# EAGLE design VarmoEmergencyStop - Rev A1 (EAGLE 7.6.0)
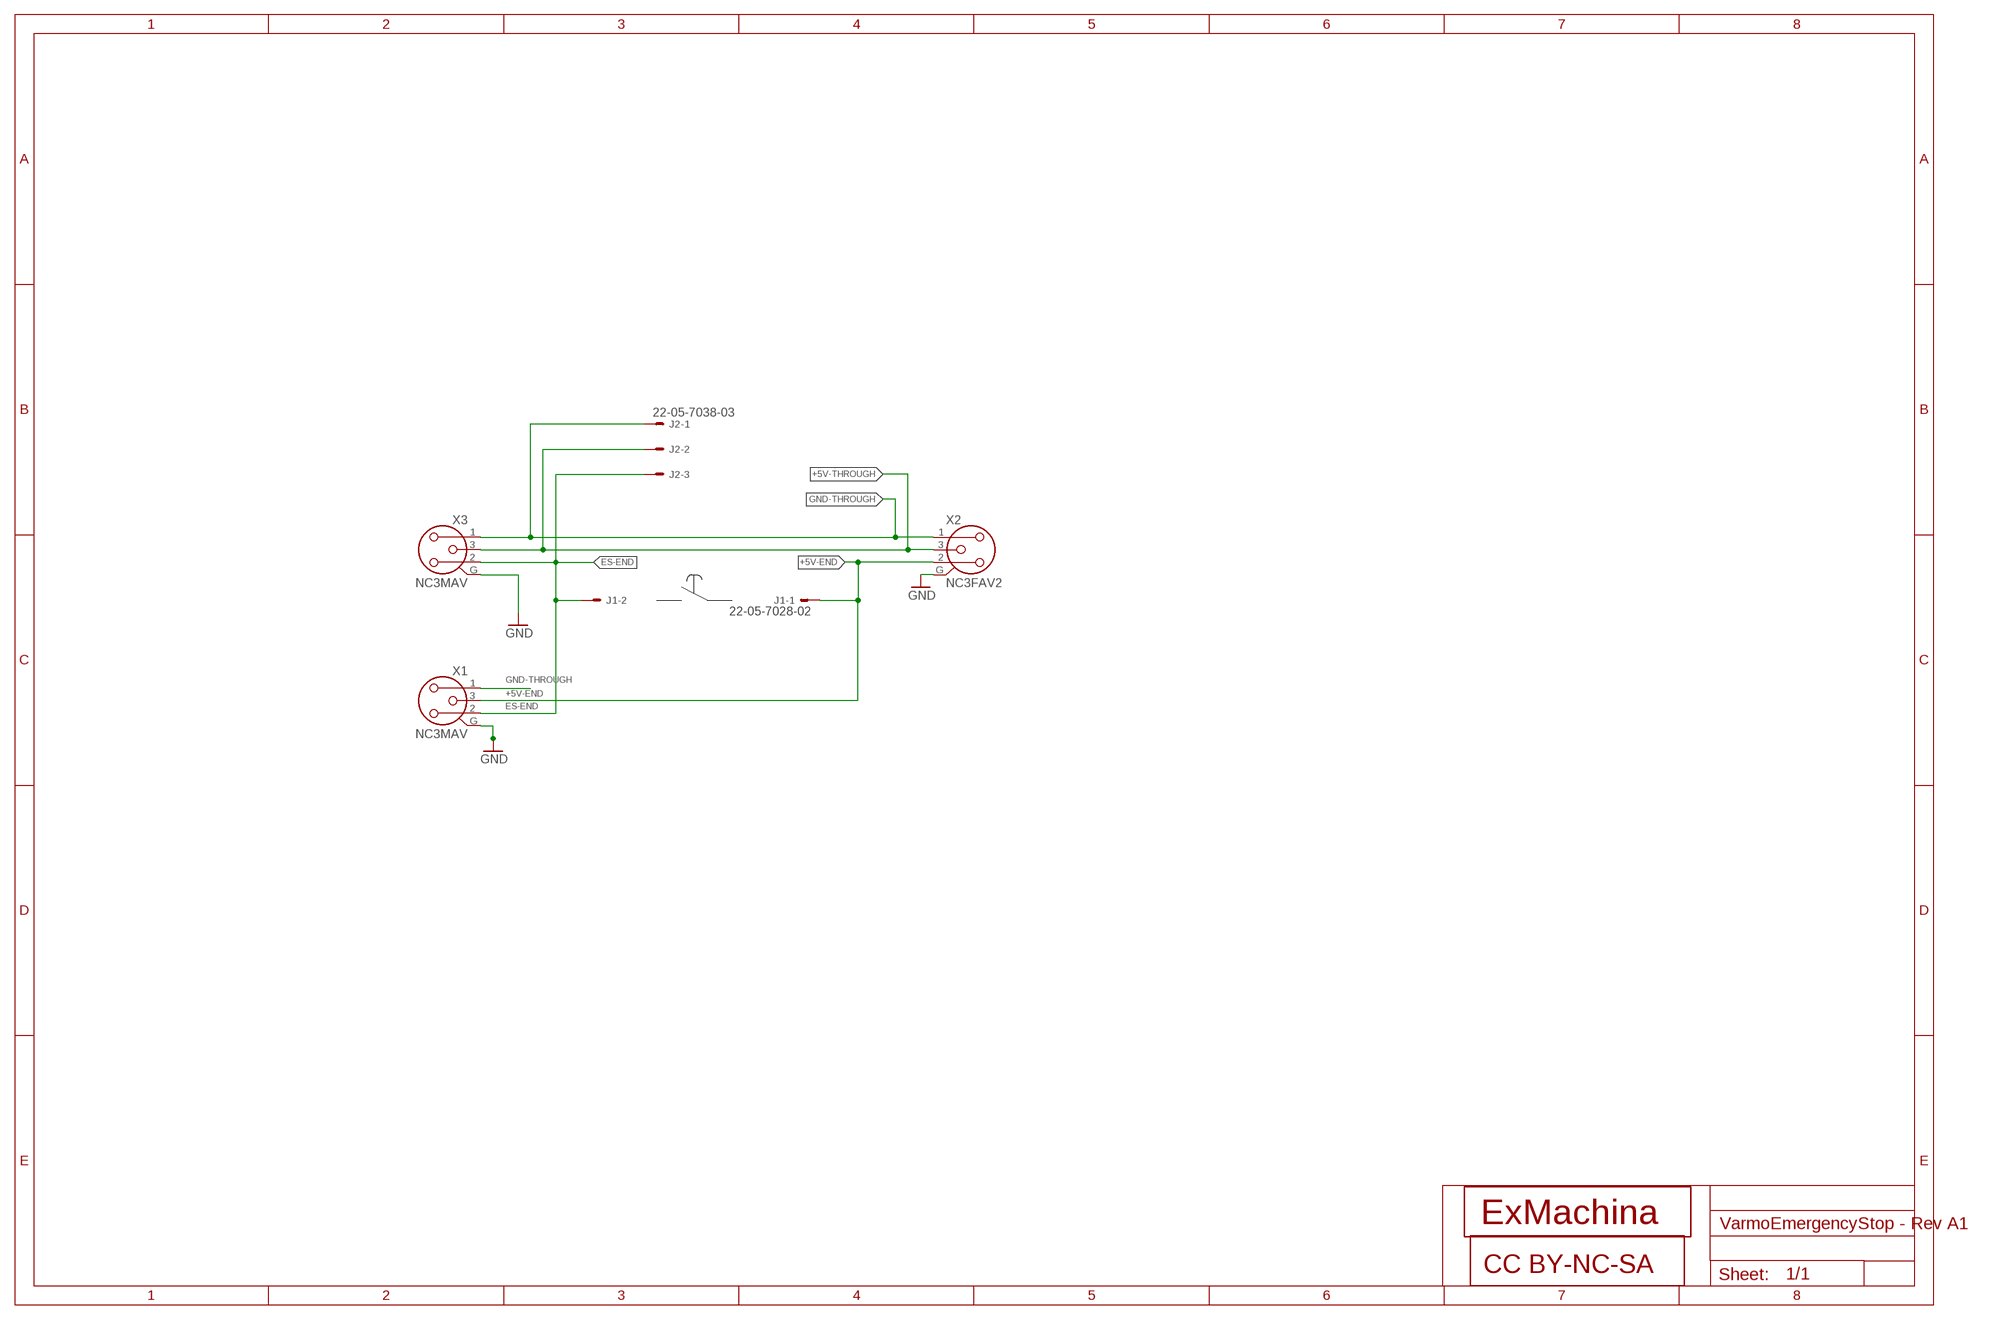
[diagram p0: schematic, sheet 1]

## Parts
J1  22-05-7028-02  [7395-02]
J2  22-05-7038-03  [7395-03]
U$1  EXMACHINA-LOGO-NAME  [EXM-LOGO-BASELINE]
U$2  CC-BY-NC-SA  [CC-BY-NC-SA]
X1  NC3MAV  [NC3MAV]
X2  NC3FAV2  [NC3FAV2]
X3  NC3MAV  [NC3MAV]

## Nets
+5V-END [power]: J1.1 X1.3 X2.2
+5V-THROUGH [power]: J2.2 X2.3 X3.3
ES-END [power]: J1.2 J2.3 X1.2 X3.2
GND [power]: X1.G X2.G X3.G
GND-THROUGH [power]: J2.1 X1.1 X2.1 X3.1

## Library data of the parts
J1 = con-molex:22-?-02: CONNECTOR wire to board 2.54 mm (.1 inch) pitch header; OC_FARNELL: 9731601; OC_NEWARK: unknown
J2 = con-molex:22-?-03: CONNECTOR wire to board 2.54 mm (.1 inch) pitch header; OC_FARNELL: 9731610; OC_NEWARK: unknown
U$1 = exmachina:EXMACHINA-LOGO
U$2 = cc-by-sa:CC-BY-NC-SA
X1 X3 = con-neutrik_ag:NC3: Neutrik Audio Connector XLR SERIES Stereo 1/4" jack Source: www.neutrik.com/; MF: FARNELL; MPN: NC3MAV; OC_FARNELL: 724531; OC_NEWARK: 46WX3058
X2 = con-neutrik_ag:NC3: Neutrik Audio Connector XLR SERIES Stereo 1/4" jack Source: www.neutrik.com/; MF: NEUTRIK; MPN: NC3FAV2; OC_FARNELL: unknown; OC_NEWARK: 83F7211

## Net classes
0 default: width 0.152 mm
1 power: width 0.813 mm, clearance 0.254 mm

## Board
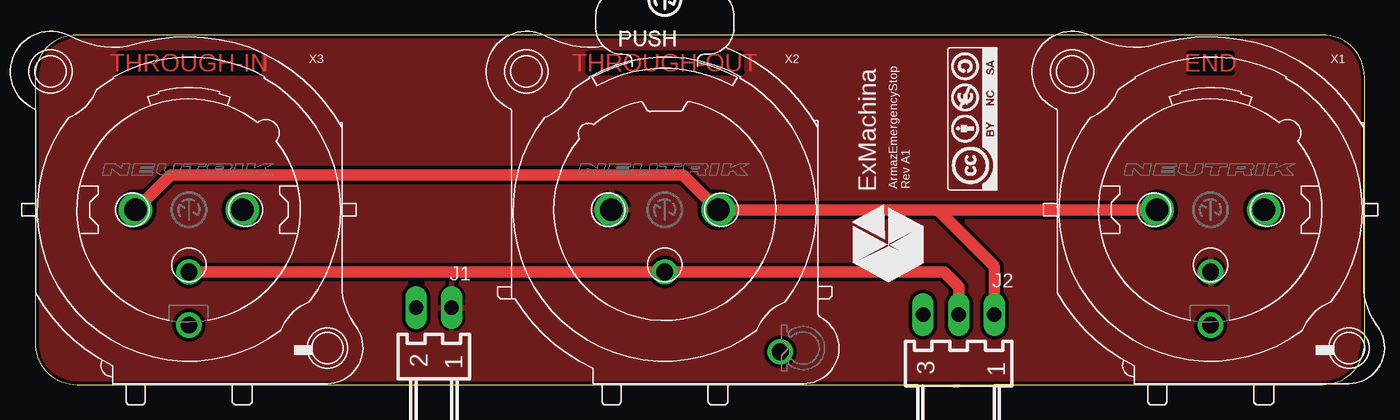
[diagram p1: board, top side]
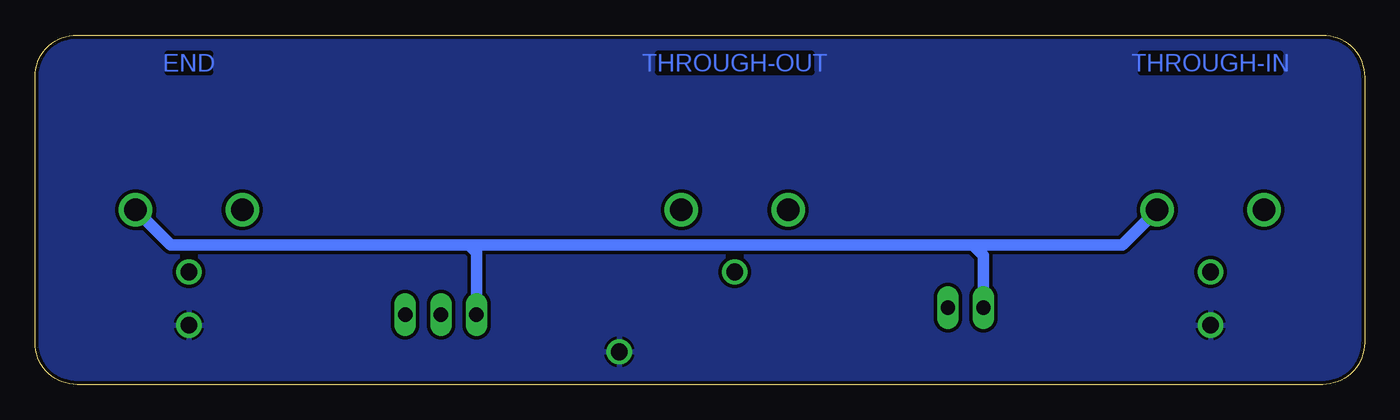
[diagram p2: board, bottom side, seen from below]

Size 95 x 25 mm. Coordinates in mm from the lower left corner, seen from the top.
Outline: 92,25 3,25 arc90 0,22 0,3 arc90 3,0 92,0 arc90 95,3 95,22 arc90 92,25
Copper layers (1*16): Top 0.018mm / dielectric 1.55mm / Bottom 0.018mm
Design rules "eC_2Layer_PClass6_BaseCopperO18_eCDefault": minimum track width 0.15mm, minimum drill 0.35mm, track to track 0.15mm, track to pad 0.15mm, pad to pad 0.15mm, via to via 0.15mm, smd to smd 0mil, copper to edge 0.25mm, drill to drill 0.35mm, minimum pad ring 0.175mm, minimum via ring 0.125mm, stop-mask expansion 0mil, vias tented up to drill 0.45mm, thermal gap 0.2mm

### Footprints (pad centres in the part's own frame; a part is rotated, then mirrored left to right if it is on the bottom)
7395-02 = drill 1.016 long: 1 1.27,0; 2 -1.27,0
7395-03 = drill 1.016 long: 1 2.54,0; 2 0,0; 3 -2.54,0
NC3MAV = drill 1.6: 1 -3.81,0; 2 3.81,0 | drill 1.2: 3 0,-4.45; G 0,-8.25
NC3FAV2 = drill 1.6: 1 3.81,0; 2 -3.81,0 | drill 1.2: 3 0,-4.45; G 8.25,-10.16

### Placement (x,y rotation side)
J1  28.5,5.5 0 top
J2  66,5 0 top
U$1  61,10 90 top
U$2  67,19 90 top
X1  84,12.5 0 top
X2  45,12.5 0 top
X3  11,12.5 0 top

### Tracks (layer width: path | path; a pad name or v marks a point on that pad's centre or on a via)
+5V-END
  pour Top: -4,-4 99,-4 99,29 -4,29
+5V-THROUGH
  Top 0.813: X3.3 X2.3 64.95,8.05 66,7 J2.2
ES-END
  Bottom 0.813: X3.2 17.31,10 28,10 | 28,10 64,10 | X1.2 85.31,10 64,10 | J2.3 63.46,9.46 64,10 | J1.2 27.23,9.23 28,10
GND
  pour Bottom: -3,-3 98,-3 98,28 -3,28
GND-THROUGH
  Top 0.813: X3.1 9.69,15 46.31,15 X2.1 64,12.5 64.5,12.5 | 64.5,12.5 68.54,8.46 J2.1 | X1.1 64.5,12.5

### Text on the board
Top: THROUGH-IN | THROUGH-OUT | END
Bottom: THROUGH-IN | THROUGH-OUT | END
tNames: ArmazEmergencyStop / Rev A1